# Altium schematic sheet 04 - OXIMETER.SchDoc
size A4; Date: 20/01/2025; SheetNumber: 4; SheetTotal: 5; Data: 20/01/2025; Revisão: RV01B; Nome da Sheet: 04 - OXIMETER
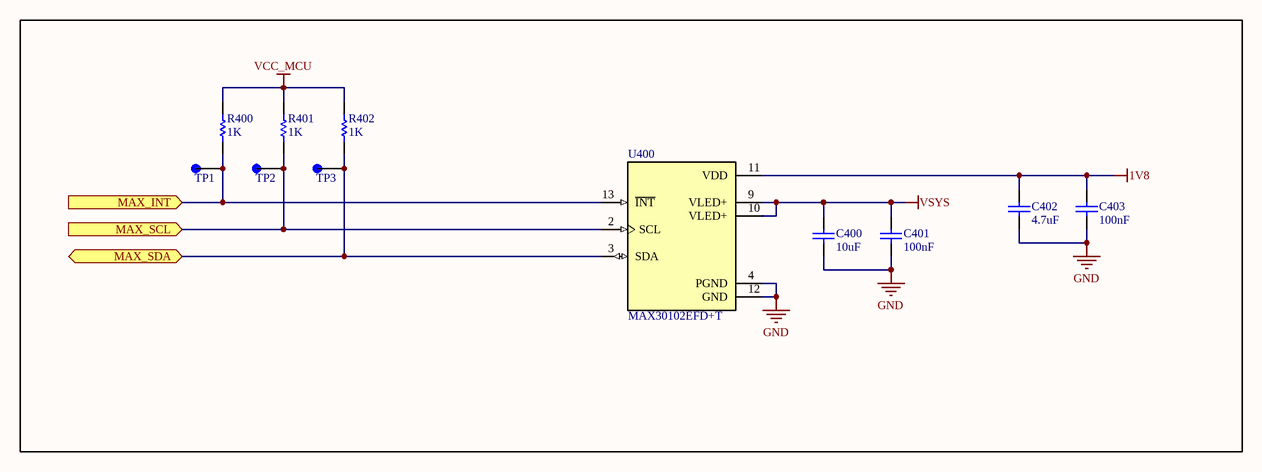
[diagram p0: 04 - OXIMETER.SchDoc]

## Parts
C400  value 10uF  [0603-C-R]  (hidden comment: CAP SMD 0603 10uF 10V ±10%)
C401  value 100nF  [0402-C-R]  (hidden comment: C0402C104K8RACTU)
C402  value 4.7uF  [0402-C-R]  (hidden comment: GRM155R61A475MEAAD)
C403  value 100nF  [0402-C-R]  (hidden comment: C0402C104K8RACTU)
R400  value 1K  [0402-R-R]  (hidden comment: RMCF0402FT1K00)
R401  value 1K  [0402-R-R]  (hidden comment: RMCF0402FT1K00)
R402  value 1K  [0402-R-R]  (hidden comment: RMCF0402FT1K00)
TP1  TEST POINT SMD  [TP SMD]  (value not drawn)
TP2  TEST POINT SMD  [TP SMD]  (value not drawn)
TP3  TEST POINT SMD  [TP SMD]  (value not drawn)
U400  PN: MAX30102EFD+T  [XDCR_MAX30101EFD+]  (hidden comment: IC SENSOR OXIMETER/HEART RATE I2C)

## Ports
MAX_INT (in), MAX_SCL (in), MAX_SDA (bidir)

## Nets
1V8: C402.2 C403.2 U400.11(VDD)
GND: C400.1 C401.1 C402.1 C403.1 U400.4(PGND) U400.12(GND)
VCC_MCU: R400.2 R401.2 R402.2
VSYS: C400.2 C401.2 U400.9(VLED+) U400.10(VLED+)
MAX_INT: R400.1 TP1.1(TP) U400.13(~{INT}) ; port MAX_INT
MAX_SCL: R401.1 TP2.1(TP) U400.2(SCL) ; port MAX_SCL
MAX_SDA: R402.1 TP3.1(TP) U400.3(SDA) ; port MAX_SDA

## Notes on the sheet
- LESC - Laboratório de Engenharia e Sistemas de Computação
- Nome da Sheet:
- Data:
- Projetista:
- PCB Design:
- Campus do Pici - Bloco 723, S/N - Pici, Fortaleza - CE, 60455-970
- Julio Vitorino
- Revision:
- Size:
- A4

## Library data of the parts
C400 = CAP SMD 0603 10uF 10V ±10%: CAP SMD 0603 MLCC GERAL 10uF 10V ±10% X7R PN: GRM188Z71A106KA73D; SIZE: 0603; PN: GRM188Z71A106KA73D; VOLTAGE: 10V; TOLERANCE: 10%
C401 C403 = CAP SMD 0402 100nF 10V ±20%: CAP SMD 0402 MLCC GERAL 100nF 10V ±20% 0402 X7R PN:C0402C104K8RACTU KEMET; SIZE: 0402; VOLTAGE: 10V; TOLERANCE: 20%; PN: C0402C104K8RACTU
C402 = CAP SMD 0402 4.7uF 10V ±20%: CAP SMD 0402 MLCC GERAL 4.7uF 10V ±20% 0402 X5R PN:GRM155R61A475MEAAD MURATA; SIZE: 0402; VOLTAGE: 10V; TOLERANCE: 20%; PN: GRM155R61A475MEAAD
R400-R402 = RES SMD 0402 1K 0.063W ±1%: RES SMD GERAL FILM 1K 0.063W ±1% 0402 7" TAPE PN: RMCF0402FT1K00 STACKPOLE; PACK: 0402; TOLERANCE: 1%; POWER: 0.063W; PN: RMCF0402FT1K00
U400 = IC SENSOR OXIMETER/HEART RATE I2C: IC SENSOR OXIMETER/HEART RATE I2C PN: MAX30102EFD+T; MF: Maxim Integrated Products; Digi-Key_Part_Number: MAX30102EFD+TTR-ND; Check_prices: https://www.snapeda.com/parts/MAX30102EFD+T/Maxim+Integrated/view-part/?ref=eda; Package: None; SnapEDA_Link: https://www.snapeda.com/parts/MAX30102EFD+T/Maxim+Integrated/view-part/?ref=snap; Value: *; Purchase-URL: https://pricing.snapeda.com/search/part/MAX30102EFD+T/?ref=eda